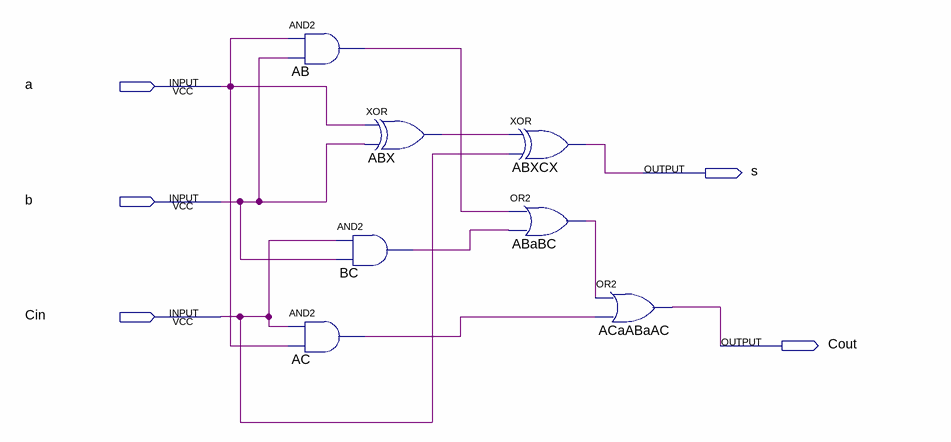
[diagram p0: schematic sheet]
// Quartus schematic Sasin Gudipati sasinkg2.bdf as structural Verilog: 7 symbols, 5 pins
module \Sasin_Gudipati_sasinkg2  (
  input  a,
  input  b,
  input  Cin,
  output s,
  output Cout
);

  wire AB_out, ABaBC_out, ABX_out, AC_out, BC_out;

  and AB (AB_out, a, b);
  and AC (AC_out, Cin, a);
  xor ABX (ABX_out, a, b);
  and BC (BC_out, Cin, b);
  xor ABXCX (s, ABX_out, Cin);
  or ABaBC (ABaBC_out, AB_out, BC_out);
  or ACaABaAC (Cout, ABaBC_out, AC_out);
endmodule
